# EAGLE design eskema_board_programacion (EAGLE 6.5.0)
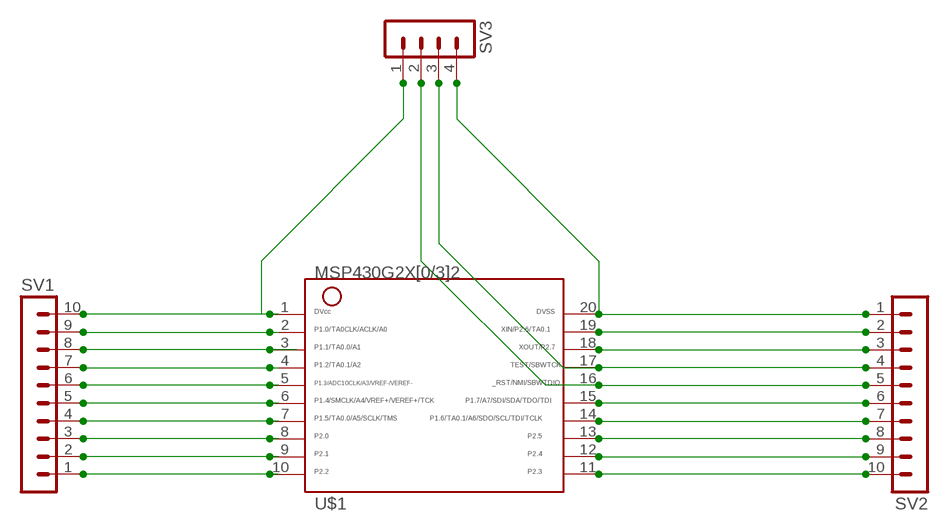
[diagram p0: schematic, sheet 1]

## Parts
SV1  MA10-1  [MA10-1]
SV2  MA10-1  [MA10-1]
SV3  MA04-1  [MA04-1]
U$1  G2X[0/3]2---N20  [N20]

## Nets
N$1: SV2.1 SV3.4 U$1.20
N$3: SV1.9 U$1.2
N$4: SV2.2 U$1.19
N$5: SV2.3 U$1.18
N$6: SV1.8 U$1.3
N$7: SV2.4 SV3.3 U$1.17
N$8: SV1.7 U$1.4
N$9: SV2.5 SV3.2 U$1.16
N$10: SV1.6 U$1.5
N$11: SV2.6 U$1.15
N$12: SV1.5 U$1.6
N$13: SV2.7 U$1.14
N$14: SV1.4 U$1.7
N$15: SV2.8 U$1.13
N$16: SV1.3 U$1.8
N$17: SV2.9 U$1.12
N$18: SV1.2 U$1.9
N$19: SV2.10 U$1.11
N$20: SV1.1 U$1.10
N$21: SV1.10 SV3.1 U$1.1

## Library data of the parts
SV1 SV2 = con-lstb:MA10-1: PIN HEADER; OC_FARNELL: unknown; OC_NEWARK: unknown
SV3 = con-lstb:MA04-1: PIN HEADER; OC_FARNELL: unknown; OC_NEWARK: unknown
U$1 = TI_MSP430_v16:G2X[0/3]2---N20: MSP430G2X[0/3]2 MSP430G2x32, MSP430G2x02 PDIP (N) 20 Pin Package http://focus.ti.com/docs/prod/folders/print/msp430g2432.html

## Board
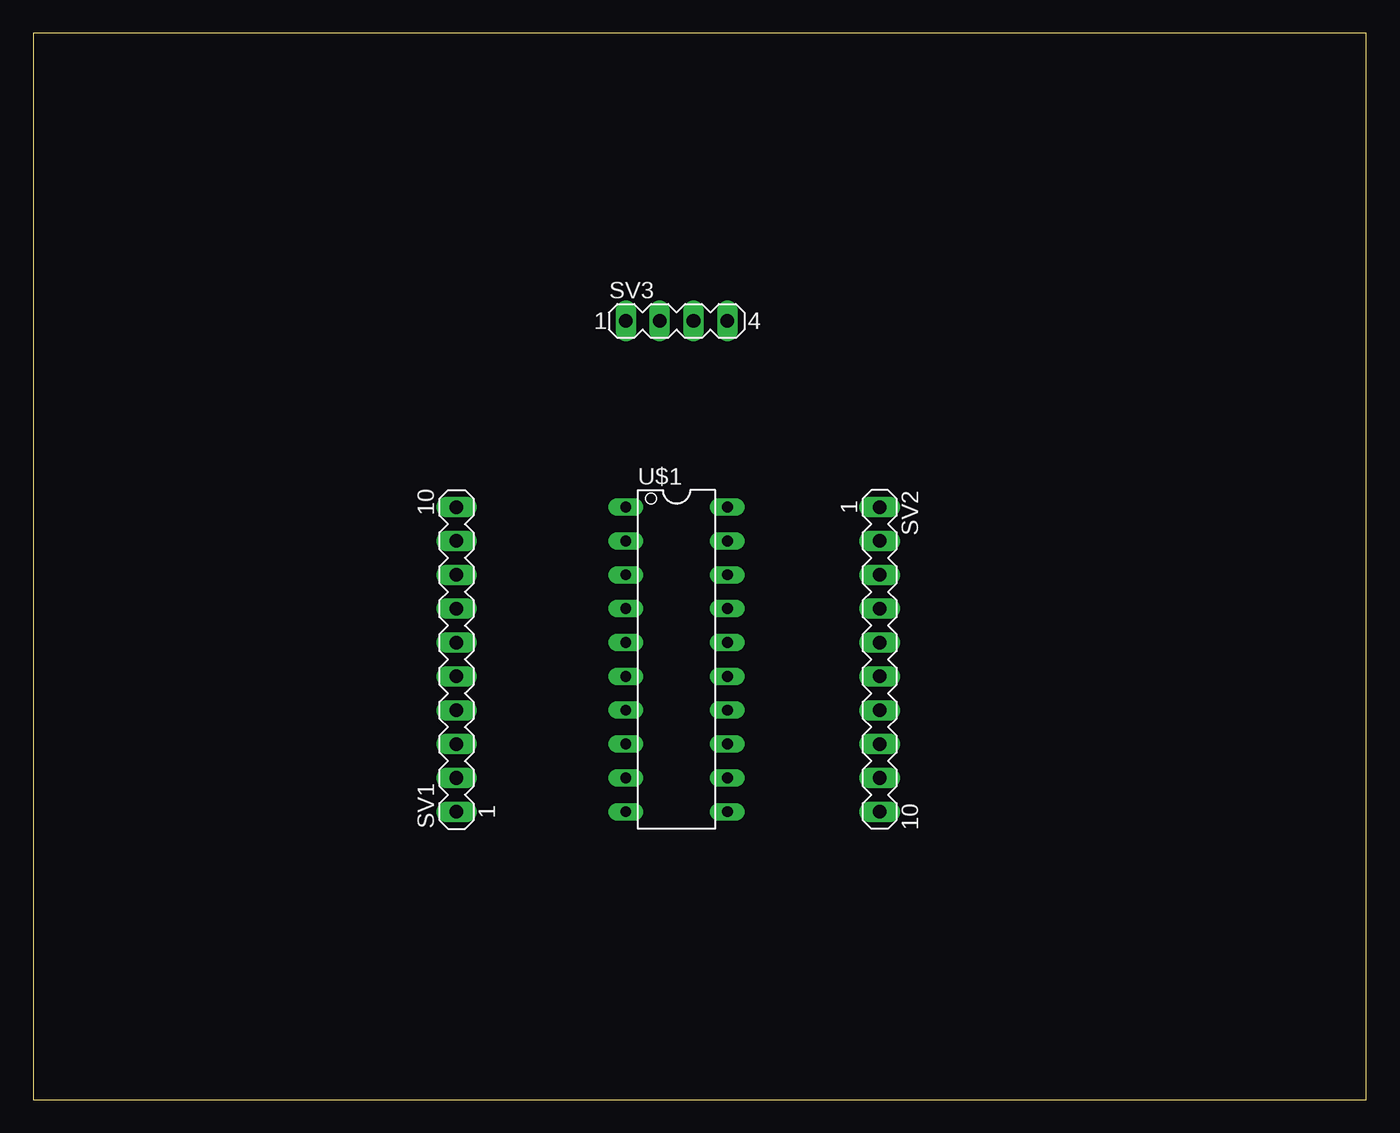
[diagram p1: board, top side]
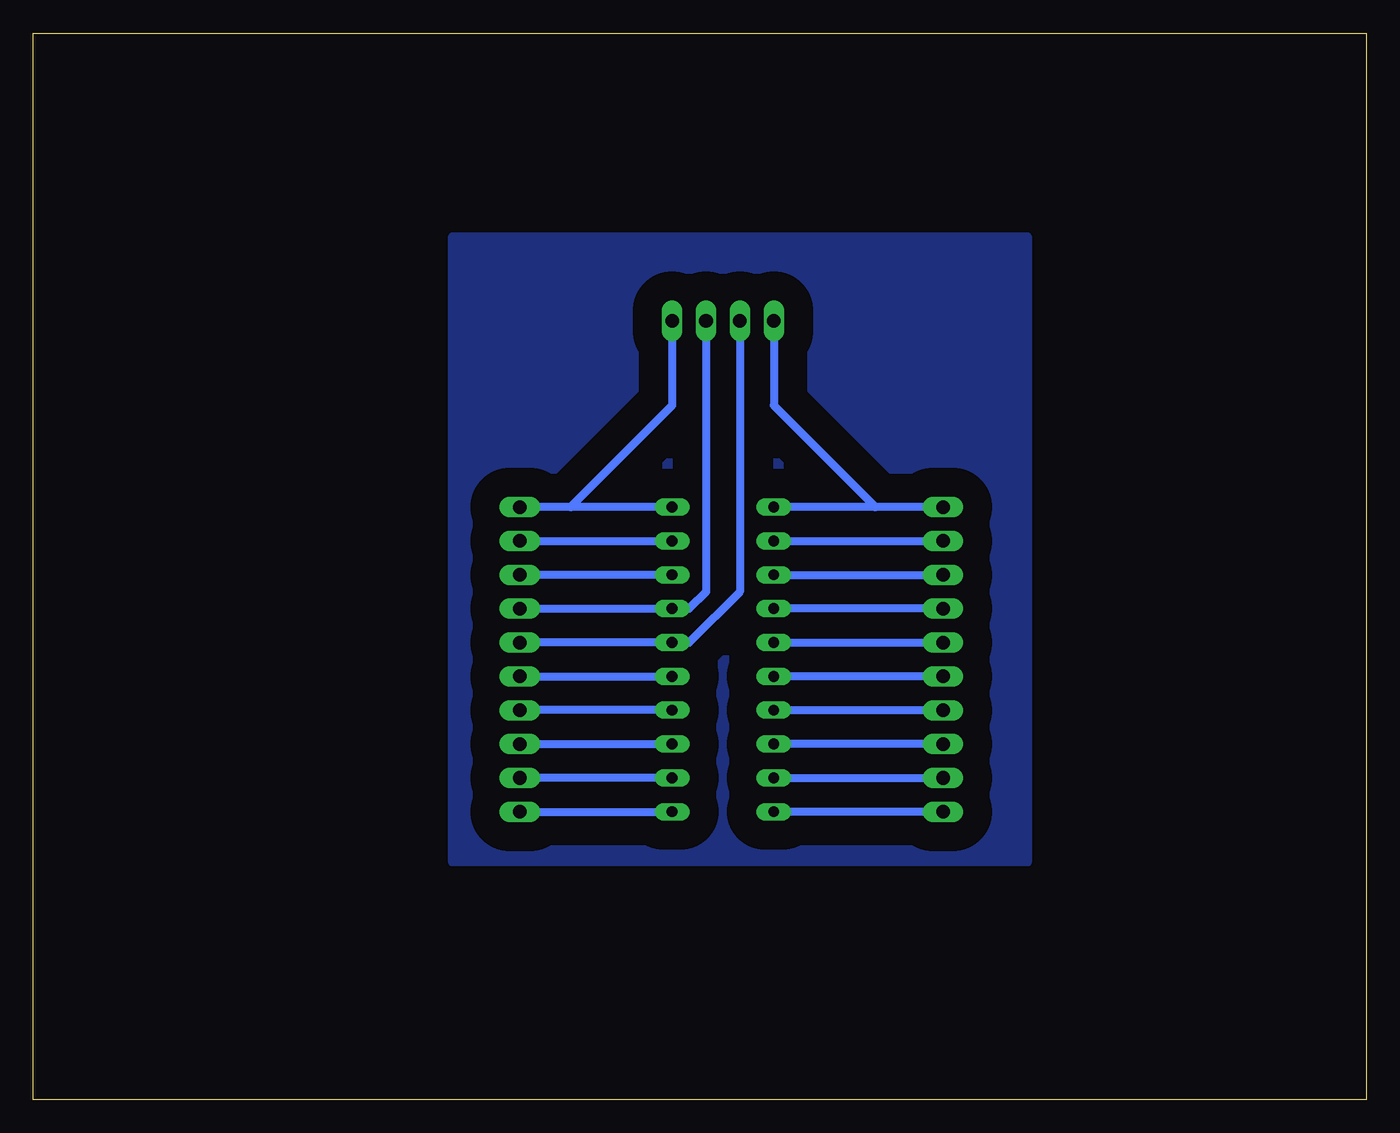
[diagram p2: board, bottom side, seen from below]

Size 100 x 80 mm. Coordinates in mm from the lower left corner, seen from the top.
Outline: 0,0 100,0 100,80 0,80 0,0
Copper layers (1*16): Top 0.035mm / dielectric 1.5mm / Bottom 0.035mm
Design rules "default": minimum track width 10mil, minimum drill 24mil, track to track 8mil, track to pad 8mil, pad to pad 8mil, via to via 8mil, smd to smd 8mil, copper to edge 40mil, drill to drill 8mil, minimum pad ring 10mil, minimum via ring 8mil, stop-mask expansion 4mil, vias tented up to drill 0mil, thermal gap 10mil

### Footprints (pad centres in the part's own frame; a part is rotated, then mirrored left to right if it is on the bottom)
MA10-1 = drill 1.016 long: 1 -11.43,0; 2 -8.89,0; 3 -6.35,0; 4 -3.81,0; 5 -1.27,0; 6 1.27,0; 7 3.81,0; 8 6.35,0; 9 8.89,0; 10 11.43,0
MA04-1 = drill 1.016 long: 1 -3.81,0; 2 -1.27,0; 3 1.27,0; 4 3.81,0
N20 = drill 0.813 long: 1 -11.435,-3.81; 2 -8.895,-3.81; 3 -6.355,-3.81; 4 -3.815,-3.81; 5 -1.275,-3.81; 6 1.265,-3.81; 7 3.805,-3.81; 8 6.345,-3.81; 9 8.885,-3.81; 10 11.425,-3.81; 11 11.425,3.81; 12 8.885,3.81; 13 6.345,3.81; 14 3.805,3.81; 15 1.265,3.81; 16 -1.275,3.81; 17 -3.815,3.81; 18 -6.355,3.81; 19 -8.895,3.81; 20 -11.435,3.81

### Placement (x,y rotation side)
SV1  31.75,33.02 90 top
SV2  63.5,33.02 270 top
SV3  48.26,58.42 0 top
U$1  48.26,33.02 270 top

### Tracks (layer width: path | path; a pad name or v marks a point on that pad's centre or on a via)
N$1
  Bottom 0.61: U$1.20 59.69,44.45 | 59.69,44.45 SV2.1 | SV3.4 52.07,52.08 59.69,44.45
N$2
  pour Bottom (isolate 2.184): 25.4,64.77 25.4,17.78 68.58,17.78 68.58,64.77
N$3
  Bottom 0.61: U$1.2 SV1.9
N$4
  Bottom 0.61: SV2.2 U$1.19
N$5
  Bottom 0.61: U$1.18 SV2.3
N$6
  Bottom 0.61: U$1.3 SV1.8
N$7
  Bottom 0.61: SV2.4 U$1.17 50.8,36.83 49.53,38.1 SV3.3
N$8
  Bottom 0.61: SV1.7 U$1.4
N$9
  Bottom 0.61: SV2.5 U$1.16 50.8,34.29 46.99,38.1 SV3.2
N$10
  Bottom 0.61: U$1.5 SV1.6
N$11
  Bottom 0.61: SV2.6 U$1.15
N$12
  Bottom 0.61: SV1.5 U$1.6
N$13
  Bottom 0.61: U$1.14 SV2.7
N$14
  Bottom 0.61: U$1.7 SV1.4
N$15
  Bottom 0.61: SV2.8 U$1.13
N$16
  Bottom 0.61: SV1.3 U$1.8
N$17
  Bottom 0.61: U$1.12 SV2.9
N$18
  Bottom 0.61: U$1.9 SV1.2
N$19
  Bottom 0.61: SV2.10 U$1.11
N$20
  Bottom 0.61: SV1.1 U$1.10
N$21
  Bottom 0.61: SV1.10 36.83,44.45 | 36.83,44.45 U$1.1 | SV3.1 44.45,52.07 36.83,44.45